# Altium schematic sheet motordriver-v3.1_A3931.SchDoc
size A3
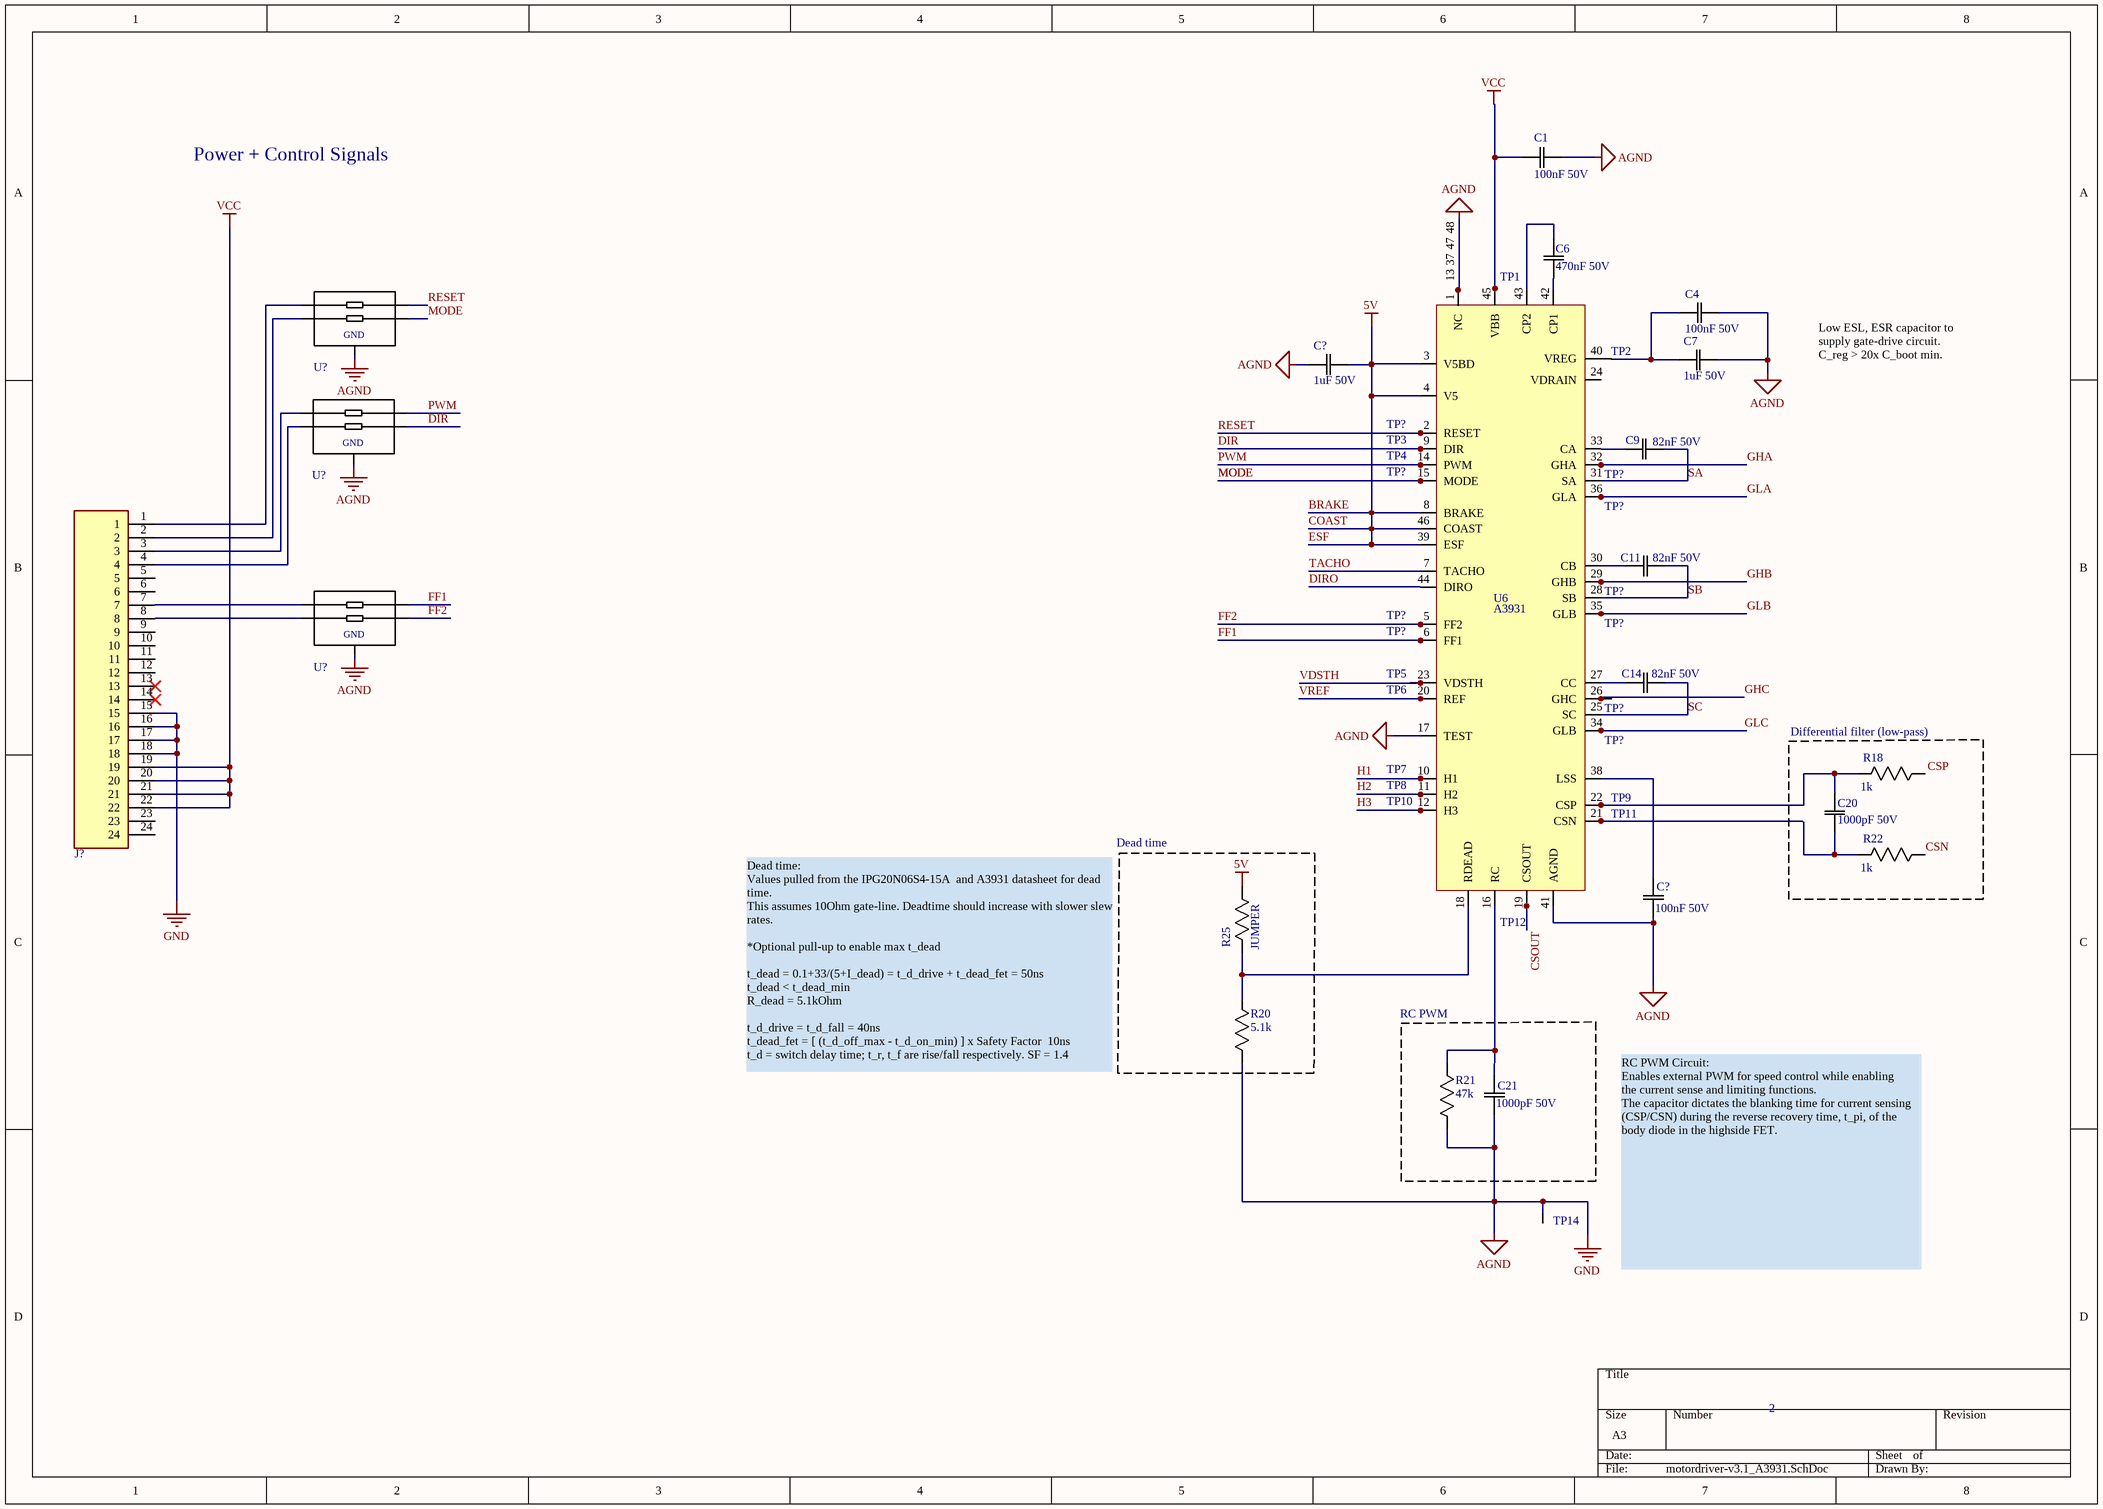
[diagram p0: motordriver-v3.1_A3931.SchDoc]

## Parts
(Parts that share a designator on the sheet are numbered #1, #2 ... from top to bottom, then left to right.)
C1  100nF 50V  [0805]
C4  100nF 50V  [0805]
C6  470nF 50V  [0805]
C7  1uF 50V  [0805]
C9  82nF 50V  [0805]
C11  82nF 50V  [0805]
C14  82nF 50V  [0805]
C20  1000pF 50V  [0805]
C21  1000pF 50V  [0805]
C?#1  1uF 50V  [0805]
C?#2  100nF 50V  [0805]
J?  CN HDR 24POS 2x12  [CN Header 24 POS (12x2)]  (value not drawn)
R18  1k  [0805]
R20  5.1k  [0805]
R21  47k  [0805]
R22  1k  [0805]
R25  JUMPER  [0805]
TP1  Test Point (Via)  [TP]  (value not drawn)
TP2  Test Point (Via)  [TP]  (value not drawn)
TP3  Test Point (Via)  [TP]  (value not drawn)
TP4  Test Point (Via)  [TP]  (value not drawn)
TP5  Test Point (Via)  [TP]  (value not drawn)
TP6  Test Point (Via)  [TP]  (value not drawn)
TP7  Test Point (Via)  [TP]  (value not drawn)
TP8  Test Point (Via)  [TP]  (value not drawn)
TP9  Test Point (Via)  [TP]  (value not drawn)
TP10  Test Point (Via)  [TP]  (value not drawn)
TP11  Test Point (Via)  [TP]  (value not drawn)
TP12  Test Point (Via)  [TP]  (value not drawn)
TP14  Test Point (Via)  [TP]  (value not drawn)
TP?#1  Test Point (Via)  [TP]  (value not drawn)
TP?#2  Test Point (Via)  [TP]  (value not drawn)
TP?#3  Test Point (Via)  [TP]  (value not drawn)
TP?#4  Test Point (Via)  [TP]  (value not drawn)
TP?#5  Test Point (Via)  [TP]  (value not drawn)
TP?#6  Test Point (Via)  [TP]  (value not drawn)
TP?#7  Test Point (Via)  [TP]  (value not drawn)
TP?#8  Test Point (Via)  [TP]  (value not drawn)
TP?#9  Test Point (Via)  [TP]  (value not drawn)
TP?#10  Test Point (Via)  [TP]  (value not drawn)
U6  A3931  [48-LQFP-EP (7x7)]
U?#1  EMI  [SOT-665]  (value not drawn)
U?#2  EMI  [SOT-665]  (value not drawn)
U?#3  EMI  [SOT-665]  (value not drawn)

## Blocks framed on the sheet
Differential filter (low-pass): C20 R18 R22
Dead time: R20 R25
RC PWM: C21 R21

## Nets
AGND: C1.1(C1) C4.2(C2) C7.2(C2) C21.1(C1) C?#1.1(C1) C?#2.1(C1) J?.15 J?.16 J?.17 J?.18 R20.2(R2) R21.2(R2) TP14.1 U6.1(NC) U6.13 U6.17(TEST) U6.37(NC) U6.41(AGND) U6.47(NC) U6.48(NC) U?#1.2(P$2) U?#2.2(P$2) U?#3.2(P$2)  [also labelled GND]
BRAKE: C?#1.2(C2) R25.1(R1) U6.3(V5BD) U6.4(V5) U6.8(BRAKE) U6.39(ESF) U6.46(COAST)  [also labelled 5V, COAST, ESF]
VCC: C1.2(C2) J?.19 J?.20 J?.21 J?.22 TP1.1 U6.45(VBB)
CSN: R22.1(R1)
CSOUT: TP12.1 U6.19(CSOUT)
DIR: TP3.1 U6.9(DIR) U?#2.3(P$3)
DIRO: U6.44(DIRO)
FF1: TP?#8.1 U6.6(FF1) U?#3.1(P$1)
FF2: TP?#7.1 U6.5(FF2) U?#3.3(P$3)
GHA: TP?#2.1 U6.32(GHA)
GHB: TP?#5.1 U6.29(GHB)
GHC: TP?#9.1 U6.26(GHC)
GLA: TP?#4.1 U6.36(GLA)
GLB: TP?#6.1 U6.35(GLB)
GLC: TP?#10.1 U6.34(GLB)
H1: TP7.1 U6.10(H1)
H2: TP8.1 U6.11(H2)
H3: TP10.1 U6.12(H3)
MODE: TP?#3.1 U6.15(MODE) U?#1.3(P$3)
PWM: TP4.1 U6.14(PWM) U?#2.1(P$1)
RESET: TP?#1.1 U6.2(RESET) U?#1.1(P$1)
SA: C9.2(C2) U6.31(SA)
SB: C11.2(C2) U6.28(SB)
SC: C14.2(C2) U6.25(SC)
TACHO: U6.7(TACHO)
VDSTH: TP5.1 U6.23(VDSTH)
VREF: TP6.1 U6.20(REF)
NetC4_1: C4.1(C1) C7.1(C1)
NetC6_1: C6.1(C1) U6.42(CP1)
NetC6_2: C6.2(C2) U6.43(CP2)
NetC9_1: C9.1(C1) U6.33(CA)
NetC11_1: C11.1(C1) U6.30(CB)
NetC14_1: C14.1(C1) U6.27(CC)
NetC20_1: C20.1(C1) R22.2(R2) TP11.1 U6.21(CSN)
NetC20_2: C20.2(C2) R18.2(R2) TP9.1 U6.22(CSP)
NetC21_2: C21.2(C2) R21.1(R1) U6.16(RC)
NetC?#2_2: C?#2.2(C2) U6.38(LSS)
NetJ?_1: J?.1 U?#1.5(P$5)
NetJ?_2: J?.2 U?#1.4(P$4)
NetJ?_3: J?.3 U?#2.5(P$5)
NetJ?_4: J?.4 U?#2.4(P$4)
NetJ?_7: J?.7 U?#3.5(P$5)
NetJ?_8: J?.8 U?#3.4(P$4)
NetR20_1: R20.1(R1) R25.2(R2) U6.18(RDEAD)
NetTP2_1: TP2.1 U6.40(VREG)

Not connected (* = marked no-connect by the designer): J? 5 6 9 10 11 12 13* 14* 23 24; R18 1(R1); U6 24(VDRAIN)

## Notes on the sheet
- Power + Control Signals
- Low ESL, ESR capacitor to supply gate-drive circuit.
  C_reg > 20x C_boot min.
- Dead time:
  Values pulled from the IPG20N06S4-15A  and A3931 datasheet for dead time.
  This assumes 10Ohm gate-line. Deadtime should increase with slower slew rates.
  *Optional pull-up to enable max t_dead
  t_dead = 0.1+33/(5+I_dead) = t_d_drive + t_dead_fet = 50ns
  t_dead < t_dead_min
  R_dead = 5.1kOhm
  t_d_drive = t_d_fall = 40ns
  t_dead_fet = [ (t_d_off_max - t_d_on_min) ] x Safety Factor  10ns
  t_d = switch delay time; t_r, t_f are rise/fall respectively. SF = 1.4
- RC PWM Circuit:
  Enables external PWM for speed control while enabling
  the current sense and limiting functions.
  The capacitor dictates the blanking time for current sensing
  (CSP/CSN) during the reverse recovery time, t_pi, of the
  body diode in the highside FET.
- 2
- Labels drawn without touching a wire or pin: CSP
- (in symbol EMI FILTER IP4256CZ5-W) GND

## Library data of the parts
C1 C4 C?#2 = CAP 100nF 50V: CAP CER 0.1UF 50V X7R 0805; Tolerance: 10%; Package: 0805; Value: 100nF; Rating: 50V
C6 = CAP 470nF 50V: CAP CER 0.1UF 50V X7R 0805; Tolerance: 10%; Package: 0805; Value: 470nF; Rating: 50V
C7 C?#1 = CAP 10uF 50V: CAP CER 10UF 50V X7R; Tolerance: 10%; Package: 1210; Value: 10uF; Rating: 50V; ComponentLink1Description: digikey; ComponentLink1URL: https://www.digikey.ca/en/products/detail/kemet/C1210C106M5RACTU/4918883
C9 C11 C14 = CAP 33nF 50V: CAP CER 0.033UF 50V X7R 0805; Value: 33nF; Tolerance: 5%; Package: 0805; Rating: 50V; Alt. Value: 33nF
C20 C21 = CAP 1000pF 50V: CAP CER 1000PF 50V X7R 0805; Tolerance: 10%; Alternative value: 1nF; Package: 0805; Value: 1000pF; Rating: 50V; Temperature Coefficient: X7R
J? = CN HDR 24POS 2x12: Pin Connector 2X12P MOD2 STIFTLEI 24 POS 0.1" 2.54mm
R18 R22 = RES 1k 1/8W: RES SMD 1K OHM 5% 1/8W 0805; Power (Watts): 0.125W; Package: 0805; Value: 1k; Tolerance: 5%
R20 = RES 5.1k 1/8W: RES SMD 5.1K OHM 1% 1/8W 0805; Power (Watts): 0.125W; Package: 0805; Value: 5.1k; Tolerance: 1%
R21 = RES 47k 1/8W: RES SMD 47K OHM 1% 1/8W 0805; Power (Watts): 0.125W; Package: 0805; Value: 47k; Tolerance: 1%
R25 = RES 0 1/8W: RES SMD 0 OHM JUMPER 1/8W 0805; Value: 0; Power (Watts): 0.125W; Package: 0805
U6 = A3931_A1: IC MOTOR DRIVER 5.5V-50V 48LQFP - Alternative Symbol; Digikey: 620-1290-1-ND; Digikey Link: https://www.digikey.ca/product-detail/en/allegro-microsystems/A3931KJPTR-T/620-1290-1-ND/2000021
U?#1-U?#3 = EMI FILTER IP4256CZ5-W: FILTER RC(PI) 100 OHM/19PF SMD; MF: Nexperia USA Inc.; MP: IP4256CZ5-W,115; SnapEDA_Link: https://www.snapeda.com/parts/IP4256CZ5-W/Nexperia%20USA%20Inc./view-part/3605439/?ref=snap; Price: 0.17 CAD; Package: SOT-665; Digikey: 1727-4718-1-ND; Digikey Link: https://www.digikey.ca/product-detail/en/nexperia-usa-inc/IP4256CZ5-W115/1727-4718-1-ND/2531158